# Altium schematic sheet schematic.SchDoc
size A4; SheetNumber: 1; SheetTotal: 1
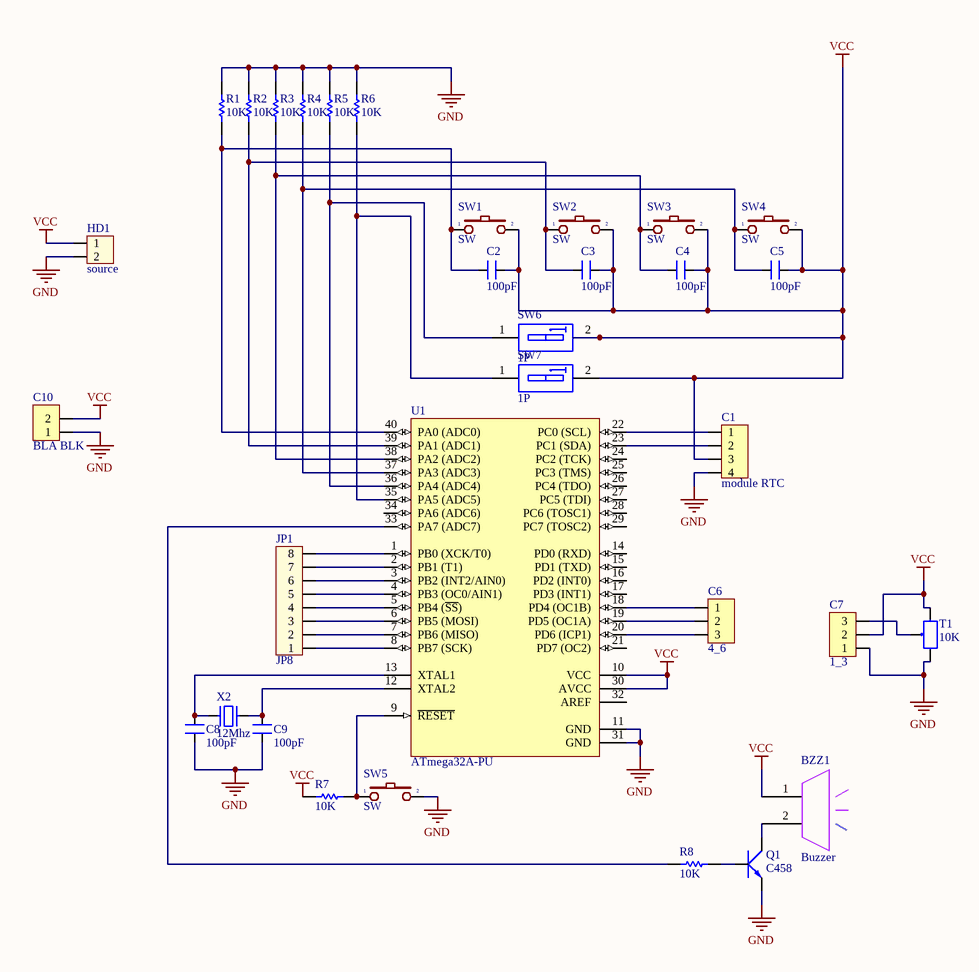
[diagram p0: schematic.SchDoc]

## Parts
BZZ1  Buzzer  [buzzer 5V]
C1  module RTC  [HDR4]
C2  100pF  [CN1]
C3  100pF  [CN1]
C4  100pF  [CN1]
C5  100pF  [CN1]
C6  4_6  [HDR3]
C7  1_3  [HDR3]
C8  100pF  [CN1]
C9  100pF  [CN1]
C10  BLA BLK  [HDR2]
HD1  source  [HED2]
JP1  JP8  [Header8]
Q1  C458  [TO92-123]
R1  value 10K  [R1/4W]  (hidden comment: Res1)
R2  value 10K  [R1/4W]  (hidden comment: Res1)
R3  value 10K  [R1/4W]  (hidden comment: Res1)
R4  value 10K  [R1/4W]  (hidden comment: Res1)
R5  value 10K  [R1/4W]  (hidden comment: Res1)
R6  value 10K  [R1/4W]  (hidden comment: Res1)
R7  value 10K  [R1/4W]  (hidden comment: Res1)
R8  value 10K  [R1/4W]  (hidden comment: Res1)
SW1  SW  [SW2]
SW2  SW  [SW2]
SW3  SW  [SW2]
SW4  SW  [SW2]
SW5  SW  [SW2]
SW6  1P  [SWITCH BIT 1]
SW7  1P  [SWITCH BIT 1]
T1  10K  [RVAR10K]
U1  ATmega32A-PU  [DIP40/W0.6]
X2  12Mhz  [XT2]

## Nets
GND: C1.4 C7.1 C8.1 C9.1 C10.1 HD1.2 Q1.1(E) R1.2 R2.2 R3.2 R4.2 R5.2 R6.2 SW5.2 T1.1 U1.11(GND) U1.31(GND)
VCC: BZZ1.1 C1.3 C2.2 C3.2 C4.2 C5.2 C7.2 C10.2 HD1.1 R7.2 SW1.2 SW2.2 SW3.2 SW4.2 SW6.2(B1) SW7.2(B1) T1.3 U1.10(VCC) U1.30(AVCC)
NetBZZ1_2: BZZ1.2 Q1.2(C)
NetC1_1: C1.1 U1.22(PC0_(SCL))
NetC1_2: C1.2 U1.23(PC1_(SDA))
NetC2_1: C2.1 R1.1 SW1.1 U1.40(PA0_(ADC0))
NetC3_1: C3.1 R2.1 SW2.1 U1.39(PA1_(ADC1))
NetC4_1: C4.1 R3.1 SW3.1 U1.38(PA2_(ADC2))
NetC5_1: C5.1 R4.1 SW4.1 U1.37(PA3_(ADC3))
NetC6_1: C6.1 U1.18(PD4_(OC1B))
NetC6_2: C6.2 U1.19(PD5_(OC1A))
NetC6_3: C6.3 U1.20(PD6_(ICP1))
NetC7_3: C7.3 T1.2
NetC8_2: C8.2 U1.13(XTAL1) X2.1
NetC9_2: C9.2 U1.12(XTAL2) X2.2
NetJP1_1: JP1.1 U1.8(PB7_(SCK))
NetJP1_2: JP1.2 U1.7(PB6_(MISO))
NetJP1_3: JP1.3 U1.6(PB5_(MOSI))
NetJP1_4: JP1.4 U1.5(PB4_(~{SS}))
NetJP1_5: JP1.5 U1.4(PB3_(OC0/AIN1))
NetJP1_6: JP1.6 U1.3(PB2_(INT2/AIN0))
NetJP1_7: JP1.7 U1.2(PB1_(T1))
NetJP1_8: JP1.8 U1.1(PB0_(XCK/T0))
NetQ1_3: Q1.3(B) R8.1
NetR5_1: R5.1 SW6.1(A1) U1.36(PA4_(ADC4))
NetR6_1: R6.1 SW7.1(A1) U1.35(PA5_(ADC5))
NetR7_1: R7.1 SW5.1 U1.9(~{RESET})
NetR8_2: R8.2 U1.33(PA7_(ADC7))

Not connected (* = marked no-connect by the designer): U1 14(PD0_(RXD)) 15(PD1_(TXD)) 16(PD2_(INT0)) 17(PD3_(INT1)) 21(PD7_(OC2)) 24(PC2_(TCK)) 25(PC3_(TMS)) 26(PC4_(TDO)) 27(PC5_(TDI)) 28(PC6_(TOSC1)) 29(PC7_(TOSC2)) 32(AREF) 34(PA6_(ADC6))

## Library data of the parts
C1 = Header4: Header IDC, 4 x 1 Pin Vertical 2.54mm Pitch (Non-Boxed, Male); Manufacturer: W¨¹rth Elektronik eiSos GmbH; partNo: 613002143121; ComponentLink1 Description: Manufacturer; ComponentLink2 Description: Datasheet; NoPins: 02; Created Date: 29 March 2013; ComponentLink1URL: http://www.we-online.com; ComponentLink2URL: http://katalog.we-online.de/em/datasheet/6130xx143121.pdf; Created by: Karrer Zheng
C2-C5 C8 C9 = CN1: Cap np  1pF - 472pF; Value: 100pF
C6 C7 = Header3: Header IDC, 3 x 1 Pin Vertical 2.54mm Pitch (Non-Boxed, Male); Manufacturer: W¨¹rth Elektronik eiSos GmbH; partNo: 613002143121; ComponentLink1 Description: Manufacturer; ComponentLink2 Description: Datasheet; NoPins: 02; Created Date: 29 March 2013; ComponentLink1URL: http://www.we-online.com; ComponentLink2URL: http://katalog.we-online.de/em/datasheet/6130xx143121.pdf; Created by: Karrer Zheng
C10 = Header2: Header IDC, 2 x 1 Pin Vertical 2.54mm Pitch (Non-Boxed, Male); Manufacturer: W¨¹rth Elektronik eiSos GmbH; partNo: 613002143121; ComponentLink1 Description: Manufacturer; ComponentLink2 Description: Datasheet; NoPins: 02; Created Date: 29 March 2013; ComponentLink1URL: http://www.we-online.com; ComponentLink2URL: http://katalog.we-online.de/em/datasheet/6130xx143121.pdf; Created by: Karrer Zheng
HD1 = Header 2: Header 2 (Green); Value: Header 2
JP1 = Header8: Connector 8; Value: Connector 8
Q1 = C458: NPN 600mW, ECB; Value: C1815
R1-R8 = Res1_1: Resistor; Manufacturer: Generic Components; Class: Passive; Published: 08/06/2000; Publisher: Altium Hobart Technology Centre; SubClass: Resistor
SW1-SW5 = SW2: Switch button 2 pin; Value: SW chip 2 pin
SW6 SW7 = Cong Tac Bits 1P: Cắm; Value: Switch Số 1P ( Công Tắc Bit 1P) Màu Đỏ; Don_Vi: Con; Ma_Hang: MH000964; Kieu_Chan: *; Ghi_Chu: *; Chung_Loai: Cắm
T1 = Bien Tro Tinh Chinh 10K: Cắm; Ma_Hang: MH003232; Ten_Linh_Kien: Biến Trở VR 103-10K 3296W; Don_Vi: Con; Kieu_Chan: *; Chung_Loai: Cắm; Ghi_Chu: *
U1 = ATmega32A-PU: 8-Bit AVR Microcontroller with 32K Bytes of In-System Programmable Flash Memory; Published: 17-Sep-2003; DatasheetVersion: 2503C-AVR-10/02; PackageVersion: revB, Sep-2001; PackageReference: 40P6; Publisher: Altium Limited; PackageDescription: 40-lead (0.600"/15.24mm Wide) Plastic Dual Inline Package (PDIP); Supplier 1: Digi-Key; Supplier Part Number 1: ATMEGA32-16PC-ND; Supplier 2: Mouser; Supplier Part Number 2: 556-ATMEGA32-16PC; Code_JEDEC: MS-011-AC; ComponentLink1Description: Datasheet; ComponentLink1URL: http://www.atmel.com/dyn/resources/prod_documents/doc2503.pdf; ComponentLink2Description: Atmel.com Home; ComponentLink2URL: http://www.atmel.com
X2 = XT2: Crystal, 32.768 KHz, -40 to 85 degC, 3.2 x 1.5 x 0.9 mm SMD; Value: 4Mhz